# Altium schematic sheet CV2018-DIFF.SchDoc
size A4
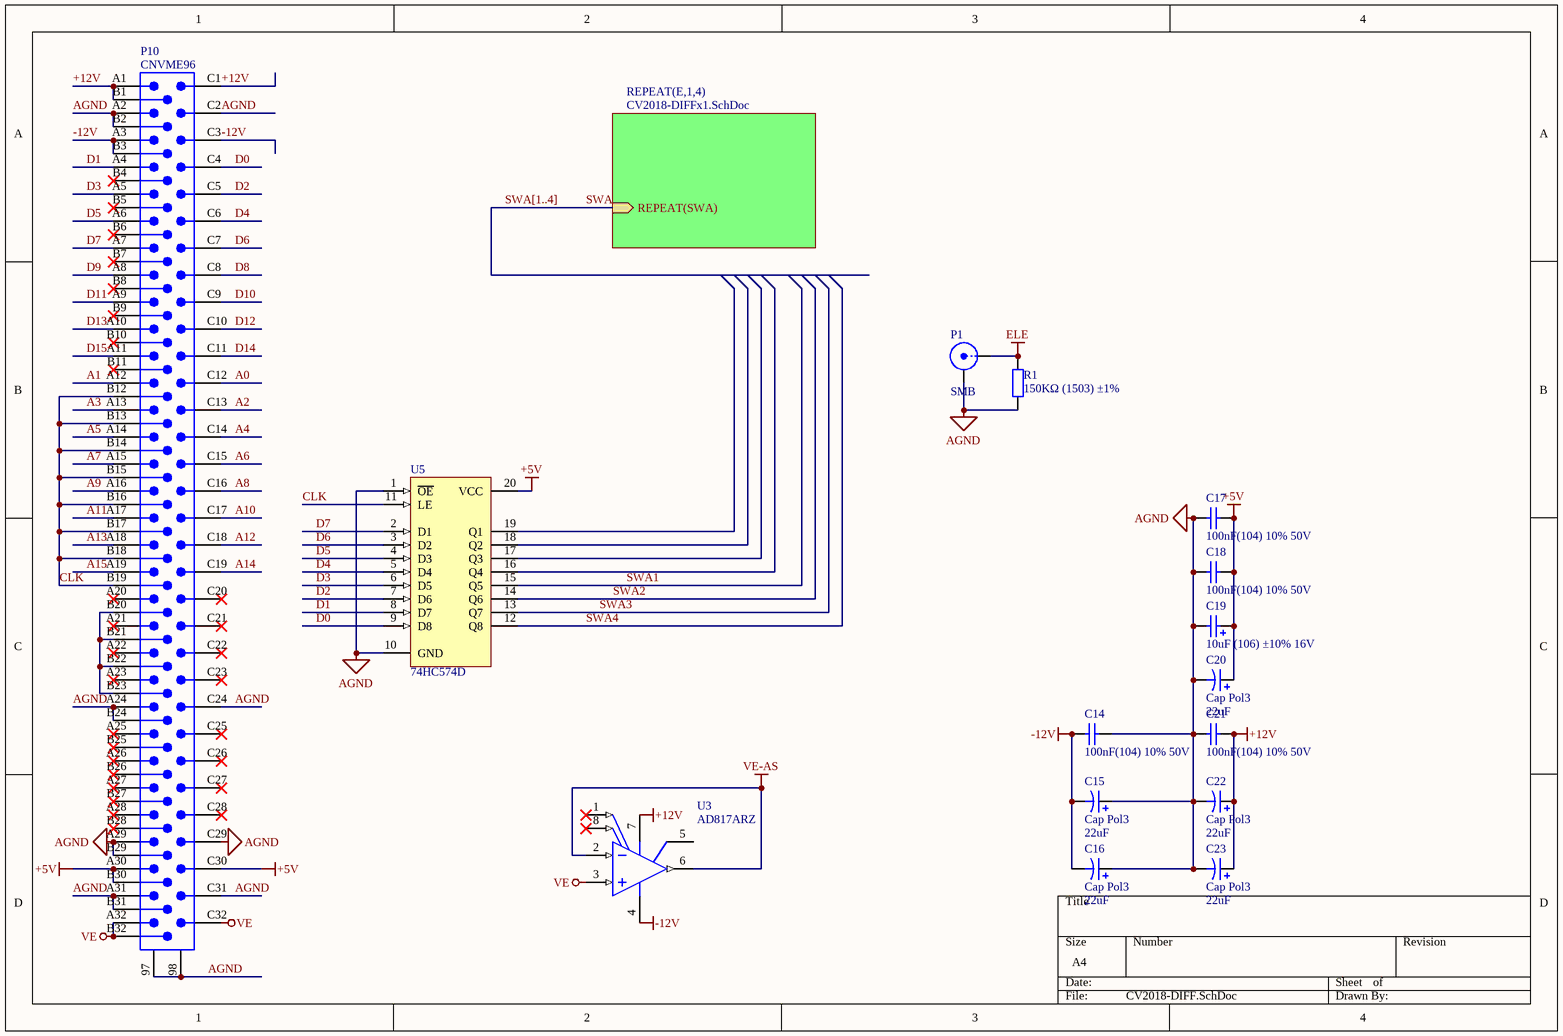
[diagram p0: CV2018-DIFF.SchDoc]

## Parts
C14  100nF(104) 10% 50V  [LC-0805_C]
C15  Cap Pol3  value 22uF  [C2225]
C16  Cap Pol3  value 22uF  [C2225]
C17  100nF(104) 10% 50V  [LC-0805_C]
C18  100nF(104) 10% 50V  [LC-0805_C]
C19  10uF (106) ±10% 16V  [LC-CASE-A_3216]
C20  Cap Pol3  value 22uF  [C2225]
C21  100nF(104) 10% 50V  [LC-0805_C]
C22  Cap Pol3  value 22uF  [C2225]
C23  Cap Pol3  value 22uF  [C2225]
P1  SMB  [SMB_V-RJ45]
P10  CNVME96  [CNVME96]
R1  150KΩ (1503) ±1%  [LC-0805_R]
U3  AD817ARZ  [ADI-R-8_N]
U5  74HC574D  [LC-SOIC-20_300mil]

## Sub-sheets
REPEAT(E,1,4) = CV2018-DIFFx1.SchDoc: REPEAT(SWA) (in)

## Nets
+5V: C17.2 C18.2 C19.1 C20.1 P10.A30 P10.B30 P10.C30 U5.20(VCC)
+12V: C21.2 C22.1 C23.1 P10.A1 P10.B1 P10.C1 U3.7(+VS)
-12V: C14.1 C15.2 C16.2 P10.A3 P10.B3 P10.C3 U3.4(-VS)
AGND: C14.2 C15.1 C16.1 C17.1 C18.1 C19.2 C20.2 C21.1 C22.2 C23.2 P1.2(Y) P10.97 P10.98 P10.A2 P10.A24 P10.A29 P10.A31 P10.B2 P10.B24 P10.B29 P10.B31 P10.C2 P10.C24 P10.C29 P10.C31 R1.2 U5.1(~{OE}) U5.10(GND)
ELE: P1.1(X) R1.1
VE: P10.A32 P10.B32 P10.C32 U3.3(+IN)
VE-AS: U3.2(-IN) U3.6(OUT)
A0: P10.C12
A1: P10.A12
A2: P10.C13
A3: P10.A13
A4: P10.C14
A5: P10.A14
A6: P10.C15
A7: P10.A15
A8: P10.C16
A9: P10.A16
A10: P10.C17
A11: P10.A17
A12: P10.C18
A13: P10.A18
A14: P10.C19
A15: P10.A19
CLK: P10.B12 P10.B13 P10.B14 P10.B15 P10.B16 P10.B17 P10.B18 P10.B19 U5.11(LE)
D0: P10.C4 U5.9(D8)
D1: P10.A4 U5.8(D7)
D2: P10.C5 U5.7(D6)
D3: P10.A5 U5.6(D5)
D4: P10.C6 U5.5(D4)
D5: P10.A6 U5.4(D3)
D6: P10.C7 U5.3(D2)
D7: P10.A7 U5.2(D1)
D8: P10.C8
D9: P10.A8
D10: P10.C9
D11: P10.A9
D12: P10.C10
D13: P10.A10
D14: P10.C11
D15: P10.A11
SWA: sheet REPEAT(E,1,4)/REPEAT(SWA)
SWA1: U5.15(Q5)
SWA2: U5.14(Q6)
SWA3: U5.13(Q7)
SWA4: U5.12(Q8)
NetP10_B20: P10.B20 P10.B21 P10.B22 P10.B23

Not connected (* = marked no-connect by the designer): P10 A20* A21* A22* A23* A25* A26* A27* A28* B4* B5* B6* B7* B8* B9* B10* B11* B25* B26* B27* B28* C20* C21* C22* C23* C25* C26* C27* C28*; U3 1(NULL)* 5(NC) 8(NULL)*; U5 16(Q4) 17(Q3) 18(Q2) 19(Q1)

## Buses and harness runs
bus SWA[1..4]

## Library data of the parts
C14 C17 C18 C21 = 0805 100nF(104) 10% 50V: 贴片电容; ComponentLink1Description: 供应商链接; ComponentLink1URL: http://www.szlcsc.com/product/details_50686.html; Package: 0805; Supplier: LC; SuppliersPartNumber: C49678
C15 C16 C20 C22 C23 = Cap Pol3: Polarized Capacitor (Surface Mount); Published: 8-Jun-2000; LatestRevisionDate: 29-May-2009; LatestRevisionNote: IPC-7351 Footprint Added.; PackageReference: C0805; Publisher: Altium Limited; PackageDescription: Chip Capacitor
C19 = 3216 10uF (106) 10% 16V: 钽电容; ComponentLink1Description: 供应商链接; ComponentLink1URL: http://www.szlcsc.com/product/details_7643.html; Package: 3216; Supplier: LC; SuppliersPartNumber: C7171
P1 = SMB: SMB Straight Connector; LatestRevisionDate: 17-Jul-2002; LatestRevisionNote: Re-released for DXP Platform.; Publisher: Altium Limited
P10 = CNVME96: 96-Pin Connector (3x32 2.54mm grid); Text Field6: Alternate Layout Available; Text Field7: Published 14-Feb-2002
R1 = 0805 150KΩ (1503) 1%: 贴片电阻; ComponentLink1Description: 供应商链接; ComponentLink1URL: http://www.szlcsc.com/product/details_18158.html; Package: 0805; Supplier: LC; SuppliersPartNumber: C17470
U3 = AD817ARZ: Single Channel Low Power Operational Amplifier, 50 MHz BW, 350 V/us SR, Industrial, 8-pin SOIC (R-8), Tube; Generic Part Number: AD817; Manufacturer: Analog Devices; Amplifiers Per Package: 1; Input Bias Current: 3.3uA; Input Offset Voltage: 500uV; Iq/Amp: 7.5mA; Small Signal Bandwidth: 50MHz; V Span Max: 36V; V Span Min: 5V; DatasheetVersion: Rev. B; PackageVersion: 060506-A; PackageReference: R-8; PackageDescription: 8-Pin Standard Small Outline Package, Body 3.9 x 4.9 mm, Pitch 1.27 mm; Supplier 1: Digi-Key; Supplier Part Number 1: AD817ARZ-ND; Supplier 2: Farnell; Supplier Part Number 2: 1660992; Supplier 3: Newark; Supplier Part Number 3: 88H0179; Slew Rate: 350V/us; Mounting Technology: Surface Mount; Code_JEDEC: MS-012-AA; PartNumber: AD817ARZ; ComponentLink1Description: Manufacturer URL; ComponentLink1URL: http://www.analog.com/en/index.html; ComponentLink2Description: Datasheet; ComponentLink2URL: http://www.analog.com/static/imported-files/data_sheets/AD817.pdf; ComponentLink3Description: Package Specification; ComponentLink3URL: http://www.analog.com/static/imported-files/packages/PKG_PDF/SOIC_Narrow%20(R)/R_8.pdf
U5 = 74HC573D: 74系列逻辑芯片; ComponentLink1Description: 供应商链接; ComponentLink1URL: http://www.szlcsc.com/product/details_6059.html; Package: SOIC-20_300mil; Supplier: LC; SuppliersPartNumber: C5608